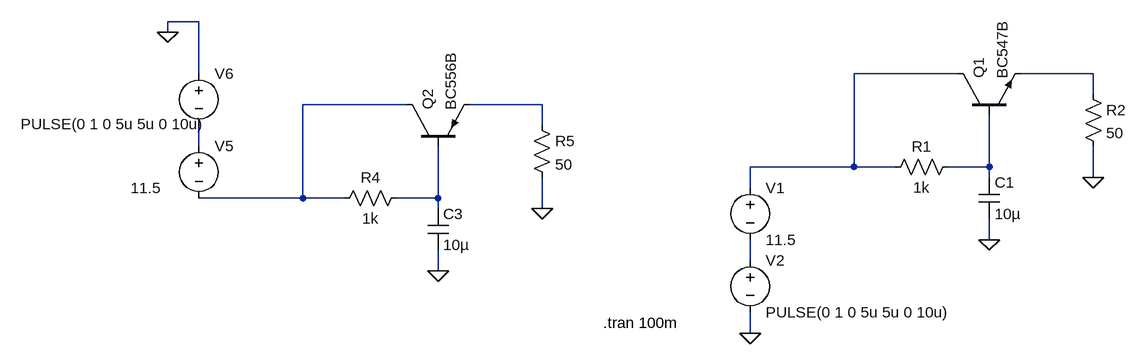
[diagram p0: schematic Filter.asc]
Filter.asc, the LTspice schematic file:
Version 4
SHEET 1 1208 680
WIRE -992 -80 -1040 -80
WIRE -1040 -64 -1040 -80
WIRE -992 0 -992 -80
WIRE 176 0 16 0
WIRE 384 0 272 0
WIRE 384 32 384 0
WIRE -672 48 -832 48
WIRE -464 48 -576 48
WIRE -464 80 -464 48
WIRE -992 112 -992 80
WIRE 16 144 16 0
WIRE 16 144 -144 144
WIRE 80 144 16 144
WIRE 224 144 224 64
WIRE 224 144 160 144
WIRE 224 160 224 144
WIRE 384 160 384 112
WIRE -144 176 -144 144
WIRE -832 192 -832 48
WIRE -832 192 -992 192
WIRE -768 192 -832 192
WIRE -624 192 -624 112
WIRE -624 192 -688 192
WIRE -624 208 -624 192
WIRE -464 208 -464 160
WIRE 224 256 224 224
WIRE -144 288 -144 256
WIRE -624 304 -624 272
WIRE -144 400 -144 368
FLAG 224 256 0
FLAG -144 400 0
FLAG 384 160 0
FLAG -624 304 0
FLAG -464 208 0
FLAG -1040 -64 0
SYMBOL res 176 128 R90
WINDOW 0 0 56 VBottom 2
WINDOW 3 32 56 VTop 2
SYMATTR InstName R1
SYMATTR Value 1k
SYMBOL cap 208 160 R0
SYMATTR InstName C1
SYMATTR Value 10µ
SYMBOL npn 176 64 R270
SYMATTR InstName Q1
SYMATTR Value BC547B
SYMBOL voltage -144 160 R0
WINDOW 123 0 0 Left 0
WINDOW 39 0 0 Left 0
SYMATTR InstName V1
SYMATTR Value 11.5
SYMBOL voltage -144 272 R0
WINDOW 123 0 0 Left 0
WINDOW 39 0 0 Left 0
SYMATTR InstName V2
SYMATTR Value PULSE(0 1 0 5u 5u 0 10u)
SYMBOL res 368 16 R0
SYMATTR InstName R2
SYMATTR Value 50
SYMBOL res -672 176 R90
WINDOW 0 0 56 VBottom 2
WINDOW 3 32 56 VTop 2
SYMATTR InstName R4
SYMATTR Value 1k
SYMBOL cap -640 208 R0
SYMATTR InstName C3
SYMATTR Value 10µ
SYMBOL voltage -992 96 R0
WINDOW 3 -105 80 Left 2
WINDOW 123 0 0 Left 0
WINDOW 39 0 0 Left 0
SYMATTR InstName V5
SYMATTR Value 11.5
SYMBOL voltage -992 -16 R0
WINDOW 3 -274 94 Left 2
WINDOW 123 0 0 Left 0
WINDOW 39 0 0 Left 0
SYMATTR InstName V6
SYMATTR Value PULSE(0 1 0 5u 5u 0 10u)
SYMBOL res -480 64 R0
SYMATTR InstName R5
SYMATTR Value 50
SYMBOL pnp -672 112 R270
SYMATTR InstName Q2
SYMATTR Value BC556B
TEXT -370 384 Left 2 !.tran 100m

The netlist it stands for:
* Filter.asc
R1 N006 N001 1k
C1 N006 0 10µ
Q1 N001 N006 N002 0 BC547B
V1 N001 N008 11.5
V2 N008 0 PULSE(0 1 0 5u 5u 0 10u)
R2 N002 0 50
R4 N007 N003 1k
C3 N007 0 10µ
V5 N005 N003 11.5
V6 0 N005 PULSE(0 1 0 5u 5u 0 10u)
R5 N004 0 50
Q2 N003 N007 N004 0 BC556B
.model NPN NPN
.model PNP PNP
.lib standard.bjt
.tran 100m
.backanno
.end